# Altium schematic sheet AMC_Connector.SchDoc: Sayma AMC
size 420 x 297 mm; $$Internal___BlkDate: 0:12:25_2-9-18; $$Internal_NAME_PLACEHOLDER: a3sheet; $$Internal_Resolution: 00001mm; $$NotCommonProperty_@NAME: AMC_Connector; $$NotCommonProperty_@PRINTORDER: 7; $$NotCommonProperty_@SHEET: 1; $$NotCommonProperty_@SHEETTOTAL: 30; CmpIndex: 8; Drawing Author: G.Kasprowicz; Drawing Number: Sayma AMC; Drawing Project: AMC FMC Carrier Board; Drawing Revision: 2.0; SymIndex: 2141; CheckedBy: P.Kulik,T.Przywozki,W.Ruclo; Author: G.Kasprowicz; CompanyName: WUT ISE; DrawnBy: G.Kasprowicz; Organization: WUT ISE; Address1: PW ISE; Address2: Nowowiejska 15/19 00-665 Warsaw; Address3: gkasprow@gmail.com; DocumentNumber: 2; Revision: 2; SheetNumber: 2; SheetTotal: 32; ModifiedBy: -; CheckedDate: -; Title2: AMC connector; DivGrp: WUT ISE; Designer: G.Kasprowicz; ModifiedDate: -; ProjectName: Sensor Box
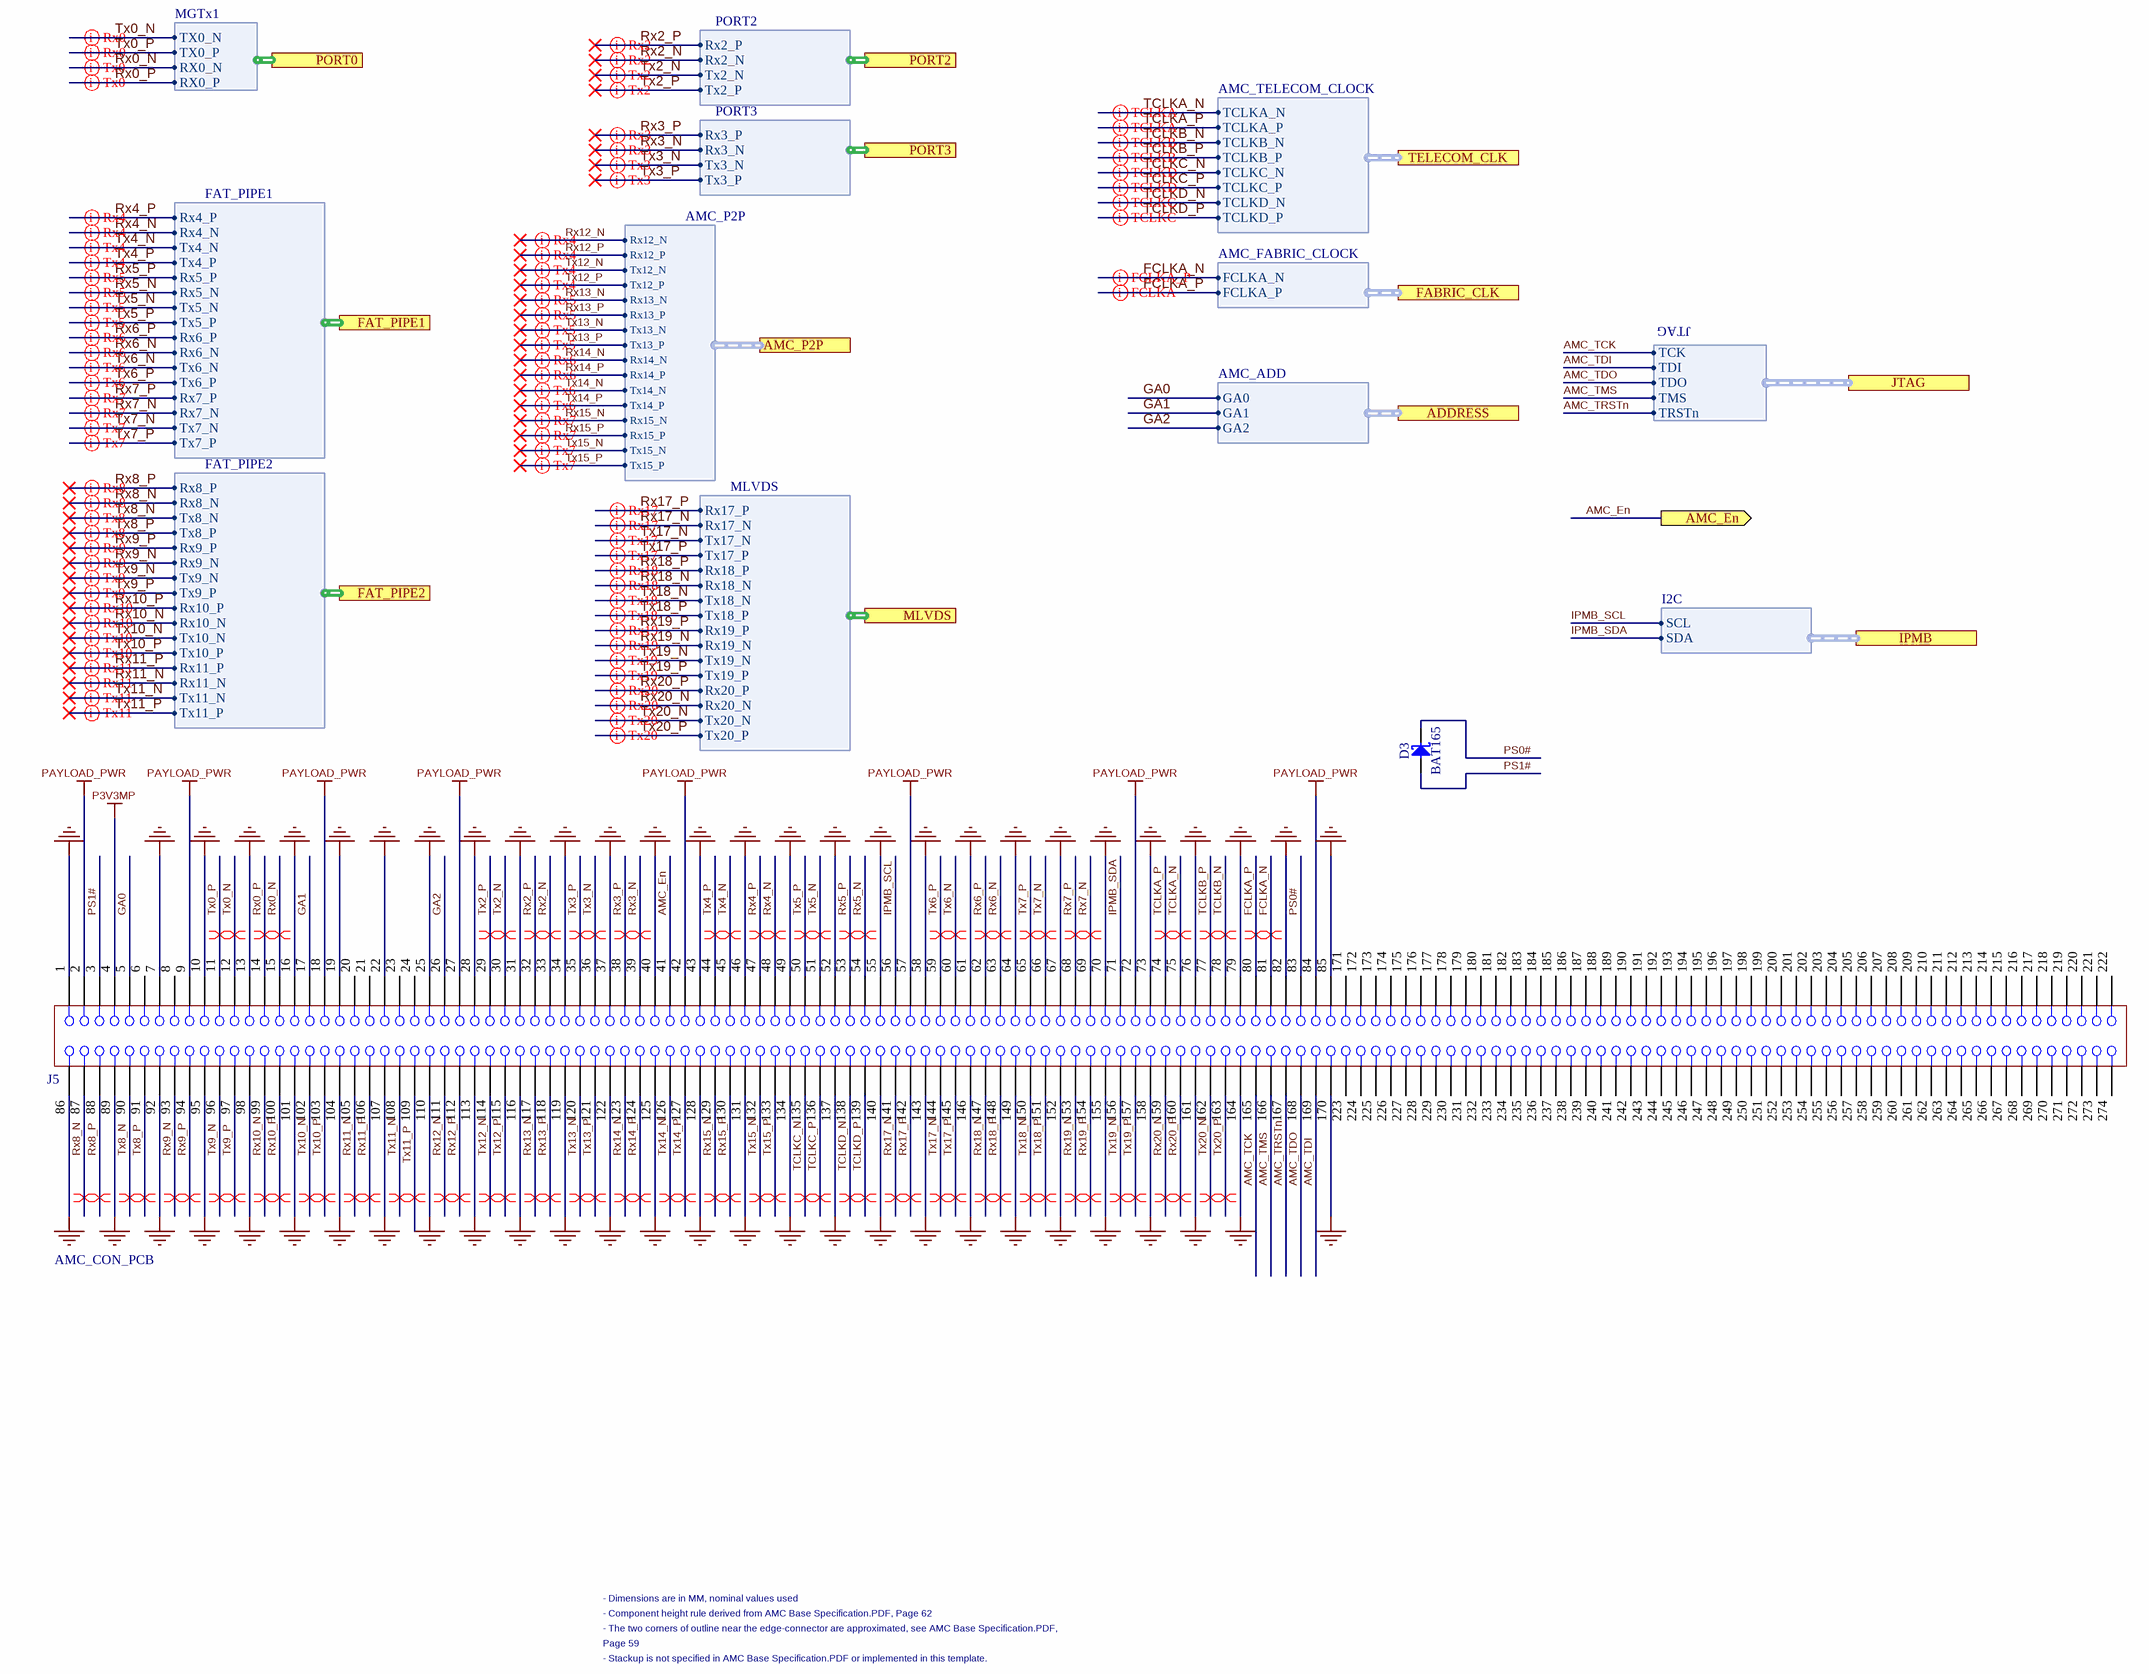
[diagram p0: AMC_Connector.SchDoc]

## Parts
D3  BAT165  [SOD2512X110N]
J5  AMC_CON_PCB

## Ports
ADDRESS (harness AMC_ADD), AMC_En (out), AMC_P2P (harness AMC_P2P), FABRIC_CLK (harness AMC_FABRIC_CLOCK), FAT_PIPE1 (harness FAT_PIPE1), FAT_PIPE2 (harness FAT_PIPE2), IPMB (harness I2C), JTAG (harness JTAG), MLVDS (harness MLVDS), PORT0 (harness MGTx1), PORT2 (harness PORT2), PORT3 (harness PORT3), TELECOM_CLK (harness AMC_TELECOM_CLOCK)

## Harnesses
FAT_PIPE1: Rx4_P, Rx4_N, Tx4_N, Tx4_P, Rx5_P, Rx5_N, Tx5_N, Tx5_P, Rx6_P, Rx6_N, Tx6_N, Tx6_P, Rx7_P, Rx7_N, Tx7_N, Tx7_P
FAT_PIPE2: Rx8_P, Rx8_N, Tx8_N, Tx8_P, Rx9_P, Rx9_N, Tx9_N, Tx9_P, Rx10_P, Rx10_N, Tx10_N, Tx10_P, Rx11_P, Rx11_N, Tx11_N, Tx11_P
MLVDS: Rx17_P, Rx17_N, Tx17_N, Tx17_P, Rx18_P, Rx18_N, Tx18_N, Tx18_P, Rx19_P, Rx19_N, Tx19_N, Tx19_P, Rx20_P, Rx20_N, Tx20_N, Tx20_P
PORT2: Rx2_P, Rx2_N, Tx2_N, Tx2_P
PORT3: Rx3_P, Rx3_N, Tx3_N, Tx3_P
AMC_P2P: Rx12_N, Rx12_P, Tx12_N, Tx12_P, Rx13_N, Rx13_P, Tx13_N, Tx13_P, Rx14_N, Rx14_P, Tx14_N, Tx14_P, Rx15_N, Rx15_P, Tx15_N, Tx15_P
AMC_TELECOM_CLOCK: TCLKA_N, TCLKA_P, TCLKB_N, TCLKB_P, TCLKC_N, TCLKC_P, TCLKD_N, TCLKD_P
AMC_FABRIC_CLOCK: FCLKA_N, FCLKA_P
AMC_ADD: GA0, GA1, GA2
I2C: SCL, SDA
JTAG: TCK, TDI, TDO, TMS, TRSTn
MGTx1: RX0_P, RX0_N, TX0_P, TX0_N

## Nets
GND: J5.1 J5.7 J5.10 J5.13 J5.16 J5.19 J5.22 J5.25 J5.28 J5.31 J5.34 J5.37 J5.40 J5.43 J5.46 J5.49 J5.52 J5.55 J5.58 J5.61 J5.64 J5.67 J5.70 J5.73 J5.76 J5.79 J5.82 J5.85 J5.86 J5.89 J5.92 J5.95 J5.98 J5.101 J5.104 J5.107 J5.110 J5.113 J5.116 J5.119 J5.122 J5.125 J5.128 J5.131 J5.134 J5.137 J5.140 J5.143 J5.146 J5.149 J5.152 J5.155 J5.158 J5.161 J5.164 J5.170
P3V3MP: J5.4
PAYLOAD_PWR: J5.2 J5.9 J5.18 J5.27 J5.42 J5.57 J5.72 J5.84
AMC_En: J5.41 ; port AMC_En
AMC_TCK: J5.165 ; port JTAG.TCK
AMC_TDI: J5.169 ; port JTAG.TDI
AMC_TDO: J5.168 ; port JTAG.TDO
AMC_TMS: J5.166 ; port JTAG.TMS
AMC_TRSTn: J5.167 ; port JTAG.TRSTn
FCLKA_N: J5.81 ; port FABRIC_CLK.FCLKA_N
FCLKA_P: J5.80 ; port FABRIC_CLK.FCLKA_P
GA0: J5.5 ; port ADDRESS.GA0
GA1: J5.17 ; port ADDRESS.GA1
GA2: J5.26 ; port ADDRESS.GA2
IPMB_SCL: J5.56 ; port IPMB.SCL
IPMB_SDA: J5.71 ; port IPMB.SDA
PS0#: D3.1(C) J5.83
PS1#: D3.2(A) J5.3
Rx0_N: J5.15 ; port PORT0.RX0_N
Rx0_P: J5.14 ; port PORT0.RX0_P
Rx2_N: J5.33 ; port PORT2.Rx2_N
Rx2_P: J5.32 ; port PORT2.Rx2_P
Rx3_N: J5.39 ; port PORT3.Rx3_N
Rx3_P: J5.38 ; port PORT3.Rx3_P
Rx4_N: J5.48 ; port FAT_PIPE1.Rx4_N
Rx4_P: J5.47 ; port FAT_PIPE1.Rx4_P
Rx5_N: J5.54 ; port FAT_PIPE1.Rx5_N
Rx5_P: J5.53 ; port FAT_PIPE1.Rx5_P
Rx6_N: J5.63 ; port FAT_PIPE1.Rx6_N
Rx6_P: J5.62 ; port FAT_PIPE1.Rx6_P
Rx7_N: J5.69 ; port FAT_PIPE1.Rx7_N
Rx7_P: J5.68 ; port FAT_PIPE1.Rx7_P
Rx8_N: J5.87 ; port FAT_PIPE2.Rx8_N
Rx8_P: J5.88 ; port FAT_PIPE2.Rx8_P
Rx9_N: J5.93 ; port FAT_PIPE2.Rx9_N
Rx9_P: J5.94 ; port FAT_PIPE2.Rx9_P
Rx10_N: J5.99 ; port FAT_PIPE2.Rx10_N
Rx10_P: J5.100 ; port FAT_PIPE2.Rx10_P
Rx11_N: J5.105 ; port FAT_PIPE2.Rx11_N
Rx11_P: J5.106 ; port FAT_PIPE2.Rx11_P
Rx12_N: J5.111 ; port AMC_P2P.Rx12_N
Rx12_P: J5.112 ; port AMC_P2P.Rx12_P
Rx13_N: J5.117 ; port AMC_P2P.Rx13_N
Rx13_P: J5.118 ; port AMC_P2P.Rx13_P
Rx14_N: J5.123 ; port AMC_P2P.Rx14_N
Rx14_P: J5.124 ; port AMC_P2P.Rx14_P
Rx15_N: J5.129 ; port AMC_P2P.Rx15_N
Rx15_P: J5.130 ; port AMC_P2P.Rx15_P
Rx17_N: J5.141 ; port MLVDS.Rx17_N
Rx17_P: J5.142 ; port MLVDS.Rx17_P
Rx18_N: J5.147 ; port MLVDS.Rx18_N
Rx18_P: J5.148 ; port MLVDS.Rx18_P
Rx19_N: J5.153 ; port MLVDS.Rx19_N
Rx19_P: J5.154 ; port MLVDS.Rx19_P
Rx20_N: J5.159 ; port MLVDS.Rx20_N
Rx20_P: J5.160 ; port MLVDS.Rx20_P
TCLKA_N: J5.75 ; port TELECOM_CLK.TCLKA_N
TCLKA_P: J5.74 ; port TELECOM_CLK.TCLKA_P
TCLKB_N: J5.78 ; port TELECOM_CLK.TCLKB_N
TCLKB_P: J5.77 ; port TELECOM_CLK.TCLKB_P
TCLKC_N: J5.135 ; port TELECOM_CLK.TCLKC_N
TCLKC_P: J5.136 ; port TELECOM_CLK.TCLKC_P
TCLKD_N: J5.138 ; port TELECOM_CLK.TCLKD_N
TCLKD_P: J5.139 ; port TELECOM_CLK.TCLKD_P
Tx0_N: J5.12 ; port PORT0.TX0_N
Tx0_P: J5.11 ; port PORT0.TX0_P
Tx2_N: J5.30 ; port PORT2.Tx2_N
Tx2_P: J5.29 ; port PORT2.Tx2_P
Tx3_N: J5.36 ; port PORT3.Tx3_N
Tx3_P: J5.35 ; port PORT3.Tx3_P
Tx4_N: J5.45 ; port FAT_PIPE1.Tx4_N
Tx4_P: J5.44 ; port FAT_PIPE1.Tx4_P
Tx5_N: J5.51 ; port FAT_PIPE1.Tx5_N
Tx5_P: J5.50 ; port FAT_PIPE1.Tx5_P
Tx6_N: J5.60 ; port FAT_PIPE1.Tx6_N
Tx6_P: J5.59 ; port FAT_PIPE1.Tx6_P
Tx7_N: J5.66 ; port FAT_PIPE1.Tx7_N
Tx7_P: J5.65 ; port FAT_PIPE1.Tx7_P
Tx8_N: J5.90 ; port FAT_PIPE2.Tx8_N
Tx8_P: J5.91 ; port FAT_PIPE2.Tx8_P
Tx9_N: J5.96 ; port FAT_PIPE2.Tx9_N
Tx9_P: J5.97 ; port FAT_PIPE2.Tx9_P
Tx10_N: J5.102 ; port FAT_PIPE2.Tx10_N
Tx10_P: J5.103 ; port FAT_PIPE2.Tx10_P
Tx11_N: J5.108 ; port FAT_PIPE2.Tx11_N
Tx11_P: J5.109 ; port FAT_PIPE2.Tx11_P
Tx12_N: J5.114 ; port AMC_P2P.Tx12_N
Tx12_P: J5.115 ; port AMC_P2P.Tx12_P
Tx13_N: J5.120 ; port AMC_P2P.Tx13_N
Tx13_P: J5.121 ; port AMC_P2P.Tx13_P
Tx14_N: J5.126 ; port AMC_P2P.Tx14_N
Tx14_P: J5.127 ; port AMC_P2P.Tx14_P
Tx15_N: J5.132 ; port AMC_P2P.Tx15_N
Tx15_P: J5.133 ; port AMC_P2P.Tx15_P
Tx17_N: J5.144 ; port MLVDS.Tx17_N
Tx17_P: J5.145 ; port MLVDS.Tx17_P
Tx18_N: J5.150 ; port MLVDS.Tx18_N
Tx18_P: J5.151 ; port MLVDS.Tx18_P
Tx19_N: J5.156 ; port MLVDS.Tx19_N
Tx19_P: J5.157 ; port MLVDS.Tx19_P
Tx20_N: J5.162 ; port MLVDS.Tx20_N
Tx20_P: J5.163 ; port MLVDS.Tx20_P

Not connected (* = marked no-connect by the designer): J5 6 8 20 21 23 24 171 172 173 174 175 176 177 178 179 180 181 182 183 184 185 186 187 188 189 190 191 192 193 194 195 196 197 198 199 200 201 202 203 204 205 206 207 208 209 210 211 212 213 214 215 216 217 218 219 220 221 222 223 224 225 226 227 228 229 230 231 232 233 234 235 236 237 238 239 240 241 242 243 244 245 246 247 248 249 250 251 252 253 254 255 256 257 258 259 260 261 262 263 264 265 266 267 268 269 270 271 272 273 274

## Layout directives
differential pair: FCLKA_N, FCLKA_P, Rx0_N, Rx0_P, Rx2_N, Rx2_P, Rx3_N, Rx3_P, Rx4_N, Rx4_P, Rx5_N, Rx5_P, Rx6_N, Rx6_P, Rx7_N, Rx7_P, Rx8_N, Rx8_P, Rx9_N, Rx9_P, Rx10_N, Rx10_P, Rx11_N, Rx11_P, Rx12_N, Rx12_P, Rx13_N, Rx13_P, Rx14_N, Rx14_P, Rx15_N, Rx15_P, Rx17_N, Rx17_P, Rx18_N, Rx18_P, Rx19_N, Rx19_P, Rx20_N, Rx20_P, TCLKA_N, TCLKA_P, TCLKB_N, TCLKB_P, TCLKC_N, TCLKC_P, TCLKD_N, TCLKD_P, Tx0_N, Tx0_P, Tx2_N, Tx2_P, Tx3_N, Tx3_P, Tx4_N, Tx4_P, Tx5_N, Tx5_P, Tx6_N, Tx6_P, Tx7_N, Tx7_P, Tx8_N, Tx8_P, Tx9_N, Tx9_P, Tx10_N, Tx10_P, Tx11_N, Tx11_P, Tx12_N, Tx12_P, Tx13_N, Tx13_P, Tx14_N, Tx14_P, Tx15_N, Tx15_P, Tx17_N, Tx17_P, Tx18_N, Tx18_P, Tx19_N, Tx19_P, Tx20_N, Tx20_P

## Notes on the sheet
- - Dimensions are in MM, nominal values used
- - Stackup is not specified in AMC Base Specification.PDF or implemented in this template.
- Page 59
- - The two corners of outline near the edge-connector are approximated, see AMC Base Specification.PDF,
- - Component height rule derived from AMC Base Specification.PDF, Page 62
- Project/Equipment
- Document
- Designer
- Drawn by
- Check.by
- Copyright WUT ISE 2018.
  This documentation describes Open Hardware and is licensed under the CERN OHL v.1.1. You may redistribute and modify this documentation under the terms of the CERN OHL v.1.1. (http://ohwr.org/CERNOHL). This documentation is distributed WITHOUT ANY EXPRESS OR IMPLIED WARRANTY, INCLUDING OF MERCHANTABILITY, SATISFACTORY QUALITY AND FITNESS FOR A PARTICULAR PURPOSE. Please see the CERN OHL v.1.1 for applicable conditions.
- Contact
- File
- Last Mod.
- Print Date
- Sheet
- Size
- A3
- of
- Rev

## Library data of the parts
D3 = BAT165: Schottky Diode; Manufacturer: INFINEON; Part Description: Medium Power AF Schottky Diode; Voltage: 40V; Power: 750mA; PressFit: No; Bonding: No; Manufacturer Part Number: BAT165; PackageDescription: Small Outline Diode (SOD-323), 1.70mm W X 1.25mm L X 1.10mm H body,  IPC Medium Density; Part Number: BAT165; Component Kind: Standard; Component Type: Standard; Device: BAT165; Pin Count: 2; Case: SOD323; Mounted: Yes; Socket: No; SMD: Yes; Sense: No; ComponentHeight: 1.1mm; HelpURL: \\cern.ch\dfs\Applications\Altium\Datasheets\BAT165.pdf; Author: CERN DEM JLC; CreateDate: 12.11.2014; LatestRevisionDate: 12.11.2014
J5 = (no symbol name): Manufacturer Part Number: pcb; Part Description: pcb connector; $$Internal_Resolution: 00001mm; Cell Name: AMC-GF-2D-750-O274; CmpIndex: 2; DXDB_LIBNAME: MISC_GK; Ref Designator: J5; SymIndex: 1622; $$Internal___BlkDate: 11:12:18_11-07-16; Manufacturer: pcb; Part Name: AMC_CON_PCB; Part Number: AMC_CON_PCB; Orientation: 0 = 0